# EAGLE design slimwatch_rev01 (EAGLE 6.1)
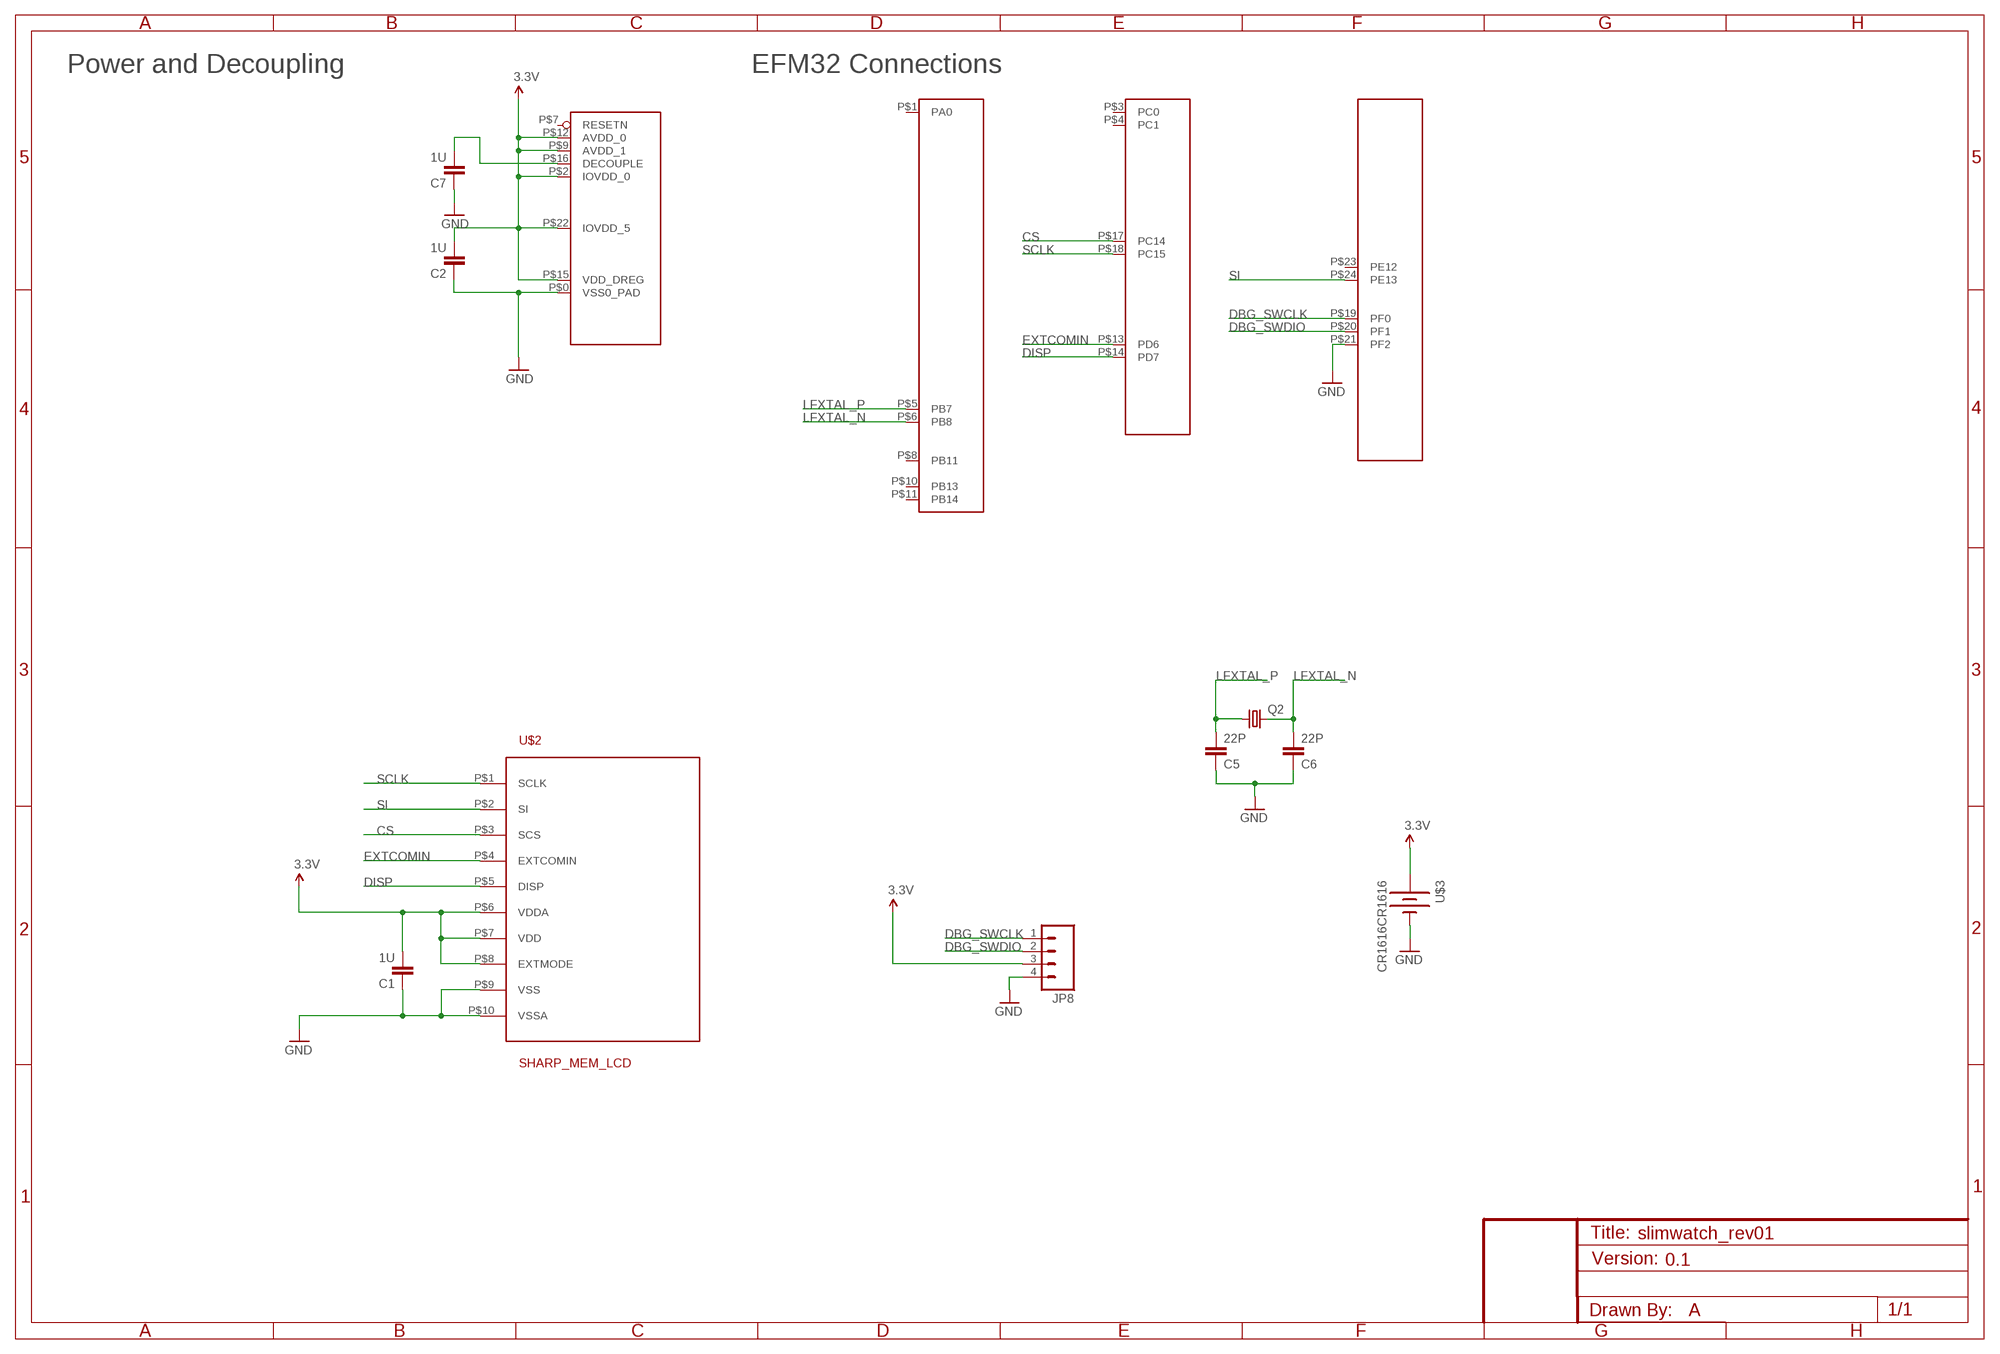
[diagram p0: schematic, sheet 1]

## Parts
C1  1U  C-EUC0603  [C0603]
C2  1U  C-EUC0603  [C0603]
C5  22P  C-EUC0603  [C0603]
C6  22P  C-EUC0603  [C0603]
C7  1U  C-EUC0603  [C0603]
JP8  M04LOCK  [1X04_LOCK]
Q2  CRYSTAL  [ABRACON_32KHZ_CRYSTAL]
U$1  EFM32GG980  [QFN24]
U$2  SHARP_MEM_LCD  [SHARP_MEM_LCD]
U$3  CR1616CR1616  [BATTCON_16MM]

## Nets
3.3V: C1.2 C2.2 JP8.3 U$1.P$2(IOVDD_0) U$1.P$9(AVDD_1) U$1.P$12(AVDD_0) U$1.P$15(VDD_DREG) U$1.P$22(IOVDD_5) U$2.P$6(VDDA) U$2.P$7(VDD) U$2.P$8(EXTMODE) U$3.P$2(+) U$3.P$3(+)
CS: U$1.P$17(PC14) U$2.P$3(SCS)
DBG_SWCLK: JP8.1 U$1.P$19(PF0)
DBG_SWDIO: JP8.2 U$1.P$20(PF1)
DISP: U$1.P$14(PD7) U$2.P$5(DISP)
EXTCOMIN: U$1.P$13(PD6) U$2.P$4(EXTCOMIN)
GND: C1.1 C2.1 C5.1 C6.1 C7.1 JP8.4 U$1.P$0(VSS0_PAD) U$1.P$21(PF2) U$2.P$9(VSS) U$2.P$10(VSSA) U$3.P$1(-)
LFXTAL_N: C6.2 Q2.P$2 U$1.P$6(PB8)
LFXTAL_P: C5.2 Q2.P$1 U$1.P$5(PB7)
N$3: C7.2 U$1.P$16(DECOUPLE)
SCLK: U$1.P$18(PC15) U$2.P$1(SCLK)
SI: U$1.P$24(PE13) U$2.P$2(SI)
Unconnected: U$1.P$1(PA0) U$1.P$3(PC0) U$1.P$4(PC1) U$1.P$7(RESETN) U$1.P$8(PB11) U$1.P$10(PB13) U$1.P$11(PB14) U$1.P$23(PE12)

## Notes on the sheet
- Power and Decoupling | EFM32 Connections
- 0.1
- A

## Library data of the parts
C1 C2 C5-C7 = rcl:C-EU: CAPACITOR, European symbol
JP8 = SparkFun_mod:M04: Header 4 Standard 4-pin 0.1" header. Use with straight break away headers (SKU : PRT-00116), right angle break away headers (PRT-00553), swiss pins (PRT-00743), machine pins (PRT-00117), and female headers (PRT-00115). Molex polarized connector foot print use with SKU : PRT-08231 with associated crimp pins and housings.
Q2 = SparkFun_mod_slimwatch:CRYSTAL: Crystals Various standard crystals. Proven footprints. Spark Fun Electronics SKU : COM-00534
U$1 = efm32tg110:EFM32GG980
U$2 = sharp_mem_lcd:SHARP_MEM_LCD
U$3 = SparkFun_mod_slimwatch:CR1616

## Board
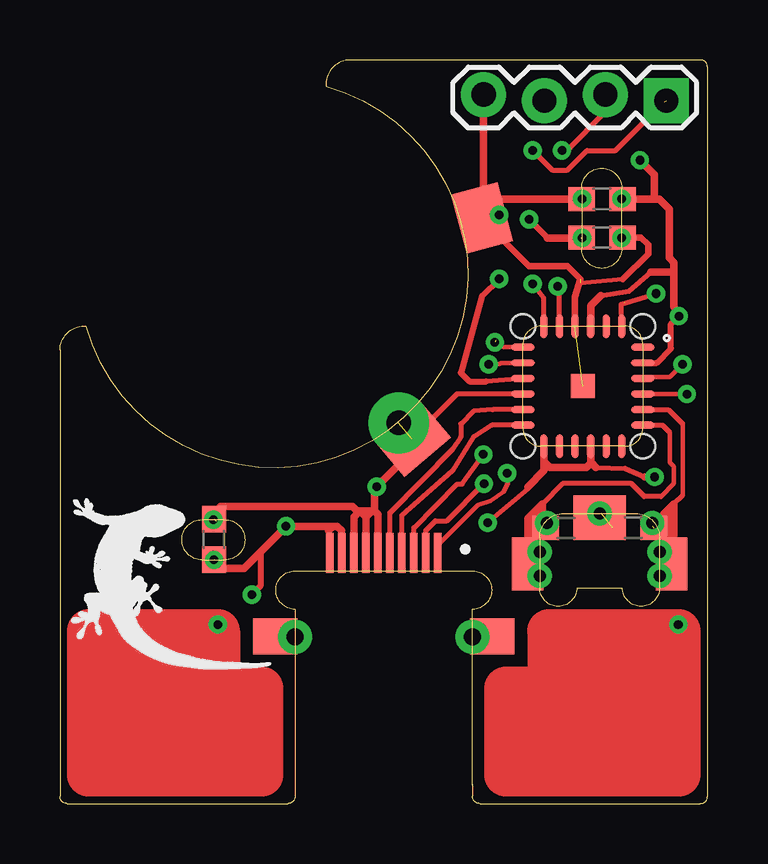
[diagram p1: board, top side]
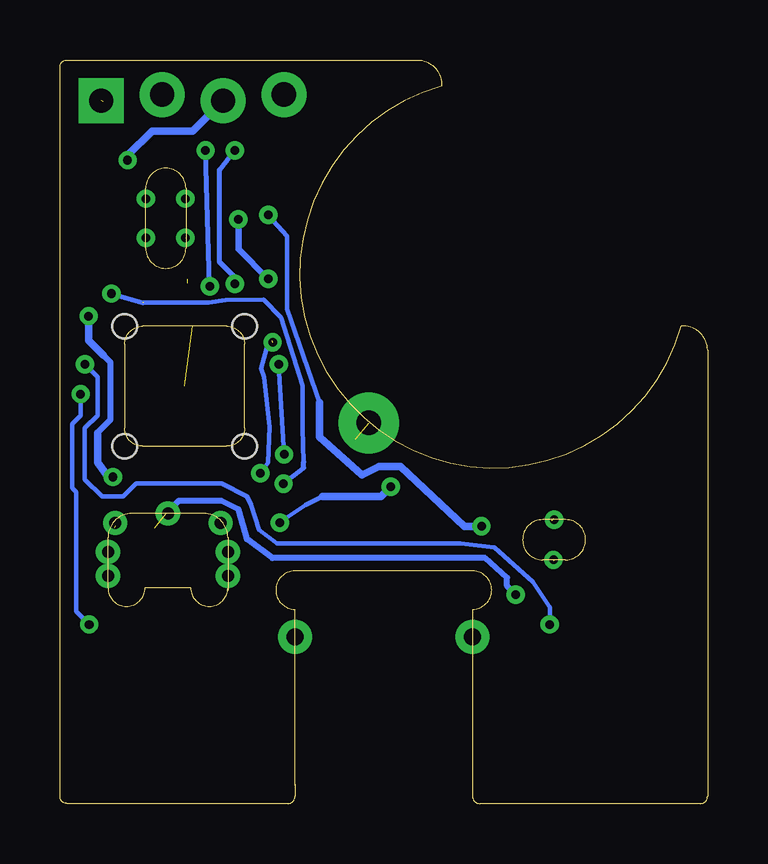
[diagram p2: board, bottom side, seen from below]

Size 27 x 31 mm. Coordinates in mm from the lower left corner, seen from the top.
Outline: 9.8,0.8 9.8,0.3 arc-90 9.5,0 0.3,0 arc-90 0,0.3 0,18.9 arc-95 1.1,19.9 arc238 11.1,29.9 arc-95 12.1,31 26.7,31 arc-90 27,30.7 27,0.3 arc-90 26.7,0 17.5,0 arc-90 17.2,0.3 17.2,0.8
Outline: 5.92,10.16 arc-180 5.92,11.84 6.87,11.84 arc-180 6.87,10.16 5.92,10.16
Outline: 23.43,23.15 arc-180 21.75,23.15 21.75,25.65 arc-180 23.43,25.65 23.43,23.15
Copper layers (1*16): Top 0.0356mm / dielectric 1.5011mm / Bottom 0.0356mm
Design rules: minimum track width 7mil, minimum drill 14mil, track to track 7mil, track to pad 7mil, pad to pad 7mil, via to via 7mil, smd to smd 0mil, copper to edge 15mil, drill to drill 8mil, minimum pad ring 10mil, minimum via ring 8mil, stop-mask expansion 4mil, vias tented up to drill 20mil, thermal gap 10mil

### Footprints (pad centres in the part's own frame; a part is rotated, then mirrored left to right if it is on the bottom)
C0603 = smd 1.1 x 1: 1 -0.85,0; 2 0.85,0
1X04_LOCK = drill 1.016 pad 1.88 square: 1 0,0.127 | drill 1.016 pad 1.88: 2 2.54,-0.127; 3 5.08,0.127; 4 7.62,-0.127
ABRACON_32KHZ_CRYSTAL = smd 1.3 x 2.2: P$1 3,0; P$2 -3,0 | drill 0.5 pad 0.9: P$3 -2.5,0.5; P$4 -2.5,-0.5; P$5 2.5,0.5; P$6 2.5,-0.5; P$7 -2.2,1.7; P$8 2.2,1.7; P$9 0,2.1 | smd 2.2 x 1.3: P$10 0,2.2
QFN24 = smd 1 x 1 bottom: P$0 0,0 | smd 1 x 0.3 bottom: P$1 -2.5,1.625; P$2 -2.5,0.975; P$3 -2.5,0.325; P$4 -2.5,-0.325; P$5 -2.5,-0.975; P$6 -2.5,-1.625; P$13 2.5,-1.625; P$14 2.5,-0.975; P$15 2.5,-0.325; P$16 2.5,0.325; P$17 2.5,0.975; P$18 2.5,1.625 | smd 0.3 x 1 bottom: P$7 -1.625,-2.5; P$8 -0.975,-2.5; P$9 -0.325,-2.5; P$10 0.325,-2.5; P$11 0.975,-2.5; P$12 1.625,-2.5; P$19 1.625,2.5; P$20 0.975,2.5; P$21 0.325,2.5; P$22 -0.325,2.5; P$23 -0.975,2.5; P$24 -1.625,2.5 | hole 1.016: -2.5,2.5; 2.5,2.5; 2.5,-2.5; -2.5,-2.5
SHARP_MEM_LCD = smd 0.3 x 1.65: P$1 2.25,0.95; P$2 1.75,0.95; P$3 1.25,0.95; P$4 0.75,0.95; P$5 0.25,0.95; P$6 -0.25,0.95; P$7 -0.75,0.95; P$8 -1.25,0.95; P$9 -1.75,0.95; P$10 -2.25,0.95 | smd 1.85 x 1.5: P$11 -4.525,-2.525; P$12 4.525,-2.525 | drill 0.7 pad 1.422: P$23 -3.7,-2.55; P$24 3.7,-2.55
BATTCON_16MM = smd 2.54 x 2 rotated 65: P$1 8.15,-3.82 | smd 2.54 x 2: P$2 0,-9 | drill 1.016 pad 2.54: P$3 0,-8.128

### Placement (x,y rotation side)
C1  6.42,11.01 90 top
C2  22.6,25.2 0 top
C5  23.9,11.5 0 top
C6  21.1,11.5 180 top
C7  22.6,23.6 180 top
JP8  25.28,29.43 180 top
Q2  22.5,10 0 top
U$1  21.8,17.4 0 bottom
U$2  13.5,9.5 0 top
U$3  8.9,22.1 40 top
U$4  [GECKO]  5.33,8.53 300 bottom
U$5  [GECKO_BOTTOM]  5.69,8.71 180 top

### Tracks (layer width: path | path; a pad name or v marks a point on that pad's centre or on a via)
3.3V  (via drill 0.36)  (2 unrouted)
  Top 0.178: 19.51,13.21 19.51,13.11 v17.84,11.71
  Top 0.203: U$1.P$15 16.55,17.07 U$3.P$2 | 22.35,14.02 23.57,13.97 24.38,13.61 | 22.55,21.18 23.72,21.36 24.64,22.15
  Top 0.254: U$1.P$2 24.88,18.38 25.48,18.97 25.48,19.99 v25.81,20.32
  Top 0.305: U$2.P$8 12.25,11.95 12.5,12.19 | U$2.P$7 12.75,11.94 | 12.75,11.94 12.5,12.19 | U$2.P$6 13.25,12.05 13.11,12.19 | 13.11,12.19 13,12.19 | 13,12.19 12.75,11.94 | 13,12.19 12.5,12.19 | U$3.P$2 14.69,14.69 v13.21,13.21 13.11,13.11 13.11,12.19 | U$1.P$9 22.12,14.2 | 22.12,14.2 21.95,14.02 20.42,14.02 20.18,14.27 U$1.P$12 20.18,13.88 19.51,13.21 | U$1.P$22 22.12,20.75 22.55,21.18 | 22.12,14.2 22.17,14.2 22.35,14.02 | 24.38,13.61 v24.79,13.61 | 24.79,25.2 24.99,25.2 25.4,24.79 25.4,22.76 25.6,22.55 25.6,22.15 | 24.79,25.2 C2.2 | 12.5,12.19 12.39,12.19 12.19,12.39 6.71,12.39 6.5,12.19 6.5,11.79 | 24.64,22.15 25.6,22.15 | v24.18,26.82 24.79,26.21 24.79,25.2 | 25.6,22.15 25.6,20.73 v25.81,20.32
  Bottom 0.178: v17.84,11.71 16.76,12.45 16.05,12.8
  Bottom 0.254: 25.43,15.44 25.43,15.47 24.89,16 24.89,18.39 25.39,18.89
  Bottom 0.305: 16.05,12.8 13.61,12.8 v13.21,13.21 | v24.79,13.61 24.99,13.61 25.43,14.22 25.43,15.44 | v24.18,26.82 24.18,27.03 23.16,28.04 21.46,28.04 JP8.3 | 25.2,18.69 25.39,18.89 25.81,19.3 v25.81,20.32
CS  (via drill 0.36)
  Top 0.178: v17.88,18.31 18.31,18.31 18.38,18.38 U$1.P$17
  Top 0.203: U$2.P$3 14.75,11.5 16.56,13.31 16.77,13.31 v17.65,14.55
  Bottom 0.178: v17.65,14.55 v17.88,18.31
DBG_SWCLK  (via drill 0.36)  (1 unrouted)
  Top 0.203: v19.71,27.23 20.52,26.42 21.16,26.42 21.97,27.23 23.16,27.23 25.2,29.26 | U$1.P$19 20.18,21.07 v19.71,21.67
  Bottom 0.203: v19.71,21.67 19.71,21.95 20.34,22.58 20.34,26.42 v19.71,27.23
DBG_SWDIO  (via drill 0.36)
  Top 0.203: U$1.P$20 20.82,21.64 v20.75,21.57 | v20.93,27.23 21.13,27.23 22.76,28.85 22.76,29.54 JP8.2
  Bottom 0.203: v20.75,21.57 v20.93,27.23
DISP
  Top 0.203: U$2.P$5 13.75,12.12 16.36,14.76 16.71,15.29 16.71,15.82 17.25,16.36 18.05,16.43 U$1.P$14
EXTCOMIN
  Top 0.203: U$2.P$4 14.25,12.02 16.36,13.87 17.25,15.29 18.01,15.78 U$1.P$13
GND  (via drill 0.36)  (4 unrouted)
  Top 0.178: v18.31,24.54 17.6,24.54 17.66,24.48 17.66,24.47 | U$2.P$10 11.2,10.45 11.2,11.38 | 11.73,10.49 11.73,11.38 | 23.47,21.87 21.69,21.69
  Top 0.254: U$2.P$9 11.75,11.36 11.56,11.56 | 8.36,10.49 8.36,9.07 v8,8.71 | C5.1 C6.1
  Top 0.279: C7.1 24.23,23.6 24.54,23.29 24.54,22.91 23.47,21.87 | U$1.P$21 21.48,21.12 21.69,21.87 21.16,22.4 19.56,22.4 17.6,24.36 U$3.P$1
  Top 0.305: 11.2,11.38 11.38,11.56 | 11.38,11.56 11.56,11.56 11.73,11.38 | JP8.4 17.66,24.47 | C2.1 18.39,25.2 17.66,24.47 | 17.66,24.47 U$3.P$1 | 6.4,10.13 6.73,9.8 7.67,9.8 8.36,10.49 v9.42,11.56 11.38,11.56
  Bottom 0.178: v18.31,24.54 17.52,23.65 17.52,20.62 16.18,16.71
  Bottom 0.254: v8,8.71 8.36,9.07 8.36,9.42 9.27,10.23 18.14,10.23 19.2,11.02 19.56,12.27 20.27,12.62 22.05,12.62 22.58,12.09
  Bottom 0.305: v9.42,11.56 10.13,11.56 12.8,14.05 13.69,14.05 14.4,13.69 16.18,15.29 16.18,16.71
LFXTAL_N
  Top 0.178: 25.43,15.47 25.43,14.22 25.6,14.05 25.6,13.34 25.07,12.8
  Top 0.203: 20.12,12.19 19.51,11.58 19.81,11.58 19.51,11.28 19.81,11.28 19.51,10.97 | U$1.P$6 25.12,15.78 25.43,15.47 | 25.07,12.8 24.36,12.8 23.82,13.34 20.95,13.34 20.12,12.5
  Top 0.305: C6.2 20.12,11.63 20.12,12.19 20.12,12.5 19.5,11.88 Q2.P$2
LFXTAL_P  (1 unrouted)
  Top 0.178: 25.96,15.82 25.96,12.85
  Top 0.203: Q2.P$1 25.54,9.99 25.6,10.06 | U$1.P$5 25.36,16.43 25.96,15.82 | 25.96,12.85 25.6,12.5
  Top 0.305: 24.69,11.58 25.6,12.5 25.6,12.19 | 24.69,11.58 24.99,11.58 | 24.99,11.58 25.6,10.97 | 25.6,10.97 25.6,10.67 | 25.6,10.06 25.6,10.67 | 25.6,10.67 24.69,11.58 | 24.99,11.58 25.3,11.58 | 25.3,11.58 25.6,11.58 | 25.6,11.58 25.6,11.28 | 25.6,10.97 25.6,11.28 | 25.6,11.28 25.3,11.58 | 25.3,11.58 25.3,11.89 25.6,12.19 | 25.6,12.19 25.6,11.58
N$1  (via drill 0.36)
  other vias: 6.4,11.84
N$2  (via drill 0.36)
  other vias: 6.43,10.16
N$3  (via drill 0.36)  (1 unrouted)
  Top 0.203: U$1.P$16 17.78,17.6
  Top 0.254: v18.31,21.87 17.6,21.16 16.71,17.96 17.07,17.6 17.78,17.6
  Top 0.279: 20.32,23.57 20.32,23.6 v19.56,24.36
  Top 0.305: 21.74,23.57 21.74,23.77 21.54,23.57 20.32,23.57
  Bottom 0.279: v19.56,24.36 19.56,23.11 v18.31,21.87
N$4  (via drill 0.36)
  other vias: 23.42,25.22
N$5  (via drill 0.36)
  other vias: 21.77,25.22
N$6  (via drill 0.36)
  Top 0.178: v25.96,18.31 25.43,17.78 24.36,17.78
  Bottom 0.178: 6.58,7.82 v6.58,7.47 6.58,8.18 7.29,9.25 8.89,10.67 10.31,10.85 17.96,10.85 18.7,11.4 19.02,12.45 19.2,12.8 20.27,13.34 23.82,13.34 24.36,12.8 25.25,12.8 25.96,13.51 25.96,15.65 25.43,16.18 25.43,17.78 v25.96,18.31
N$7  (via drill 0.36)
  other vias: 21.77,23.59
N$8  (via drill 0.36)
  other vias: 23.42,23.59
N$11  (via drill 0.36)
  Top 0.178: 24.36,17.07 v26.14,17.07
  Bottom 0.178: v26.14,17.07 26.14,16.18 26.49,15.82 26.49,13.16 26.31,12.98 26.31,8 v25.78,7.47
SCLK  (via drill 0.36)  (1 unrouted)
  Top 0.178: U$2.P$1 15.75,10.77 17.42,12.45 17.96,12.62 18.49,12.98 18.67,13.34 18.69,13.54 v18.64,13.77 | U$1.P$18 18.49,19.02 v18.13,19.23
  Bottom 0.178: v18.64,13.77 18.31,14.22 18.26,15.7 18.49,17.78 18.62,18.14 18.31,19.2 18.19,19.3
SI  (via drill 0.36)  (1 unrouted)
  Top 0.203: U$2.P$2 15.25,11.39 15.65,11.79 16.13,11.79 v17.68,13.34 | U$1.P$24 23.4,20.82 v24.86,21.26
  Bottom 0.178: 16.84,14.25 16.89,15.65 16.89,17.42 17.78,20.27 18.52,21.01 20.09,20.98 20.8,20.88 23.52,20.88
  Bottom 0.203: v24.86,21.26 23.55,20.88 | v17.68,13.34 16.84,13.99 16.84,14.25
(copper drawn outside any net)
  shapes: Top area x10, Top circle x10

### Text on the board
tValues: Touch 1 | Touch 2 | 51907
bValues: rev 0.1 | slmwtch